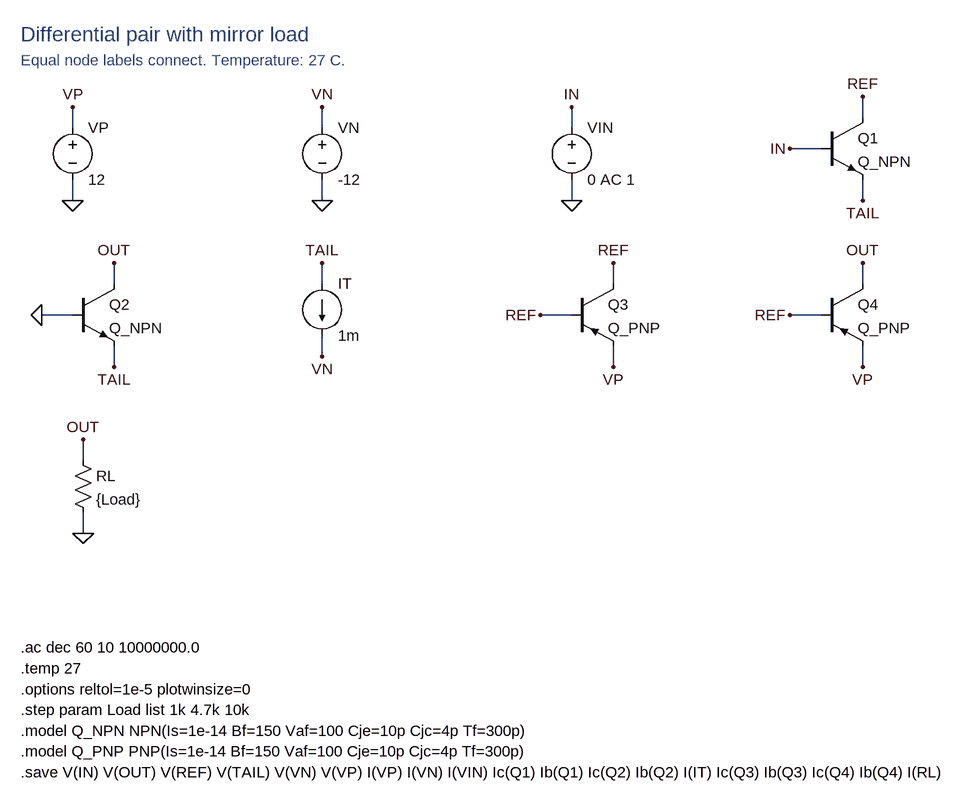
[diagram p0: schematic differential-mirror-load.asc]
differential-mirror-load.asc, the LTspice schematic file:
Version 4
SHEET 1 1740 1320
WIRE 144 176 144 144
WIRE 144 256 144 288
WIRE 528 176 528 144
WIRE 528 256 528 288
WIRE 912 176 912 144
WIRE 912 256 912 288
WIRE 1360 160 1360 128
WIRE 1296 208 1248 208
WIRE 1360 256 1360 288
WIRE 208 416 208 384
WIRE 144 464 96 464
WIRE 208 512 208 544
WIRE 528 416 528 384
WIRE 528 496 528 528
WIRE 976 416 976 384
WIRE 912 464 864 464
WIRE 976 512 976 544
WIRE 1360 416 1360 384
WIRE 1296 464 1248 464
WIRE 1360 512 1360 544
WIRE 160 688 160 656
WIRE 160 768 160 800
FLAG 144 144 VP
FLAG 144 288 0
FLAG 528 144 VN
FLAG 528 288 0
FLAG 912 144 IN
FLAG 912 288 0
FLAG 1360 128 REF
FLAG 1248 208 IN
FLAG 1360 288 TAIL
FLAG 208 384 OUT
FLAG 96 464 0
FLAG 208 544 TAIL
FLAG 528 384 TAIL
FLAG 528 528 VN
FLAG 976 384 REF
FLAG 864 464 REF
FLAG 976 544 VP
FLAG 1360 384 OUT
FLAG 1248 464 REF
FLAG 1360 544 VP
FLAG 160 656 OUT
FLAG 160 800 0
SYMBOL voltage 144 160 R0
SYMATTR InstName VP
SYMATTR Value 12
SYMBOL voltage 528 160 R0
SYMATTR InstName VN
SYMATTR Value -12
SYMBOL voltage 912 160 R0
SYMATTR InstName VIN
SYMATTR Value 0 AC 1
SYMBOL npn 1296 160 R0
SYMATTR InstName Q1
SYMATTR Value Q_NPN
SYMBOL npn 144 416 R0
SYMATTR InstName Q2
SYMATTR Value Q_NPN
SYMBOL current 528 416 R0
SYMATTR InstName IT
SYMATTR Value 1m
SYMBOL pnp 912 416 R0
SYMATTR InstName Q3
SYMATTR Value Q_PNP
SYMBOL pnp 1296 416 R0
SYMATTR InstName Q4
SYMATTR Value Q_PNP
SYMBOL res 144 672 R0
SYMATTR InstName RL
SYMATTR Value {Load}
TEXT 64 32 Left 3 ;Differential pair with mirror load
TEXT 64 72 Left 2 ;Equal node labels connect. Temperature: 27 C.
TEXT 64 976 Left 2 !.ac dec 60 10 10000000.0
TEXT 64 1008 Left 2 !.temp 27
TEXT 64 1040 Left 2 !.options reltol=1e-5 plotwinsize=0
TEXT 64 1072 Left 2 !.step param Load list 1k 4.7k 10k
TEXT 64 1104 Left 2 !.model Q_NPN NPN(Is=1e-14 Bf=150 Vaf=100 Cje=10p Cjc=4p Tf=300p)
TEXT 64 1136 Left 2 !.model Q_PNP PNP(Is=1e-14 Bf=150 Vaf=100 Cje=10p Cjc=4p Tf=300p)
TEXT 64 1168 Left 2 !.save V(IN) V(OUT) V(REF) V(TAIL) V(VN) V(VP) I(VP) I(VN) I(VIN) Ic(Q1) Ib(Q1) Ic(Q2) Ib(Q2) I(IT) Ic(Q3) Ib(Q3) Ic(Q4) Ib(Q4) I(RL)

The netlist it stands for:
* differential-mirror-load.asc
VP VP 0 12
VN VN 0 -12
VIN IN 0 0 AC 1
Q1 REF IN TAIL 0 Q_NPN
Q2 OUT 0 TAIL 0 Q_NPN
IT TAIL VN 1m
Q3 REF REF VP 0 Q_PNP
Q4 OUT REF VP 0 Q_PNP
RL OUT 0 {Load}
.model NPN NPN
.model PNP PNP
.lib standard.bjt
* Differential pair with mirror load
* Equal node labels connect. Temperature: 27 C.
.ac dec 60 10 10000000.0
.temp 27
.options reltol=1e-5 plotwinsize=0
.step param Load list 1k 4.7k 10k
.model Q_NPN NPN(Is=1e-14 Bf=150 Vaf=100 Cje=10p Cjc=4p Tf=300p)
.model Q_PNP PNP(Is=1e-14 Bf=150 Vaf=100 Cje=10p Cjc=4p Tf=300p)
.save V(IN) V(OUT) V(REF) V(TAIL) V(VN) V(VP) I(VP) I(VN) I(VIN) Ic(Q1) Ib(Q1) Ic(Q2) Ib(Q2) I(IT) Ic(Q3) Ib(Q3) Ic(Q4) Ib(Q4) I(RL)
.backanno
.end